# EAGLE schematic bs_prod (EAGLE 6.5.0)
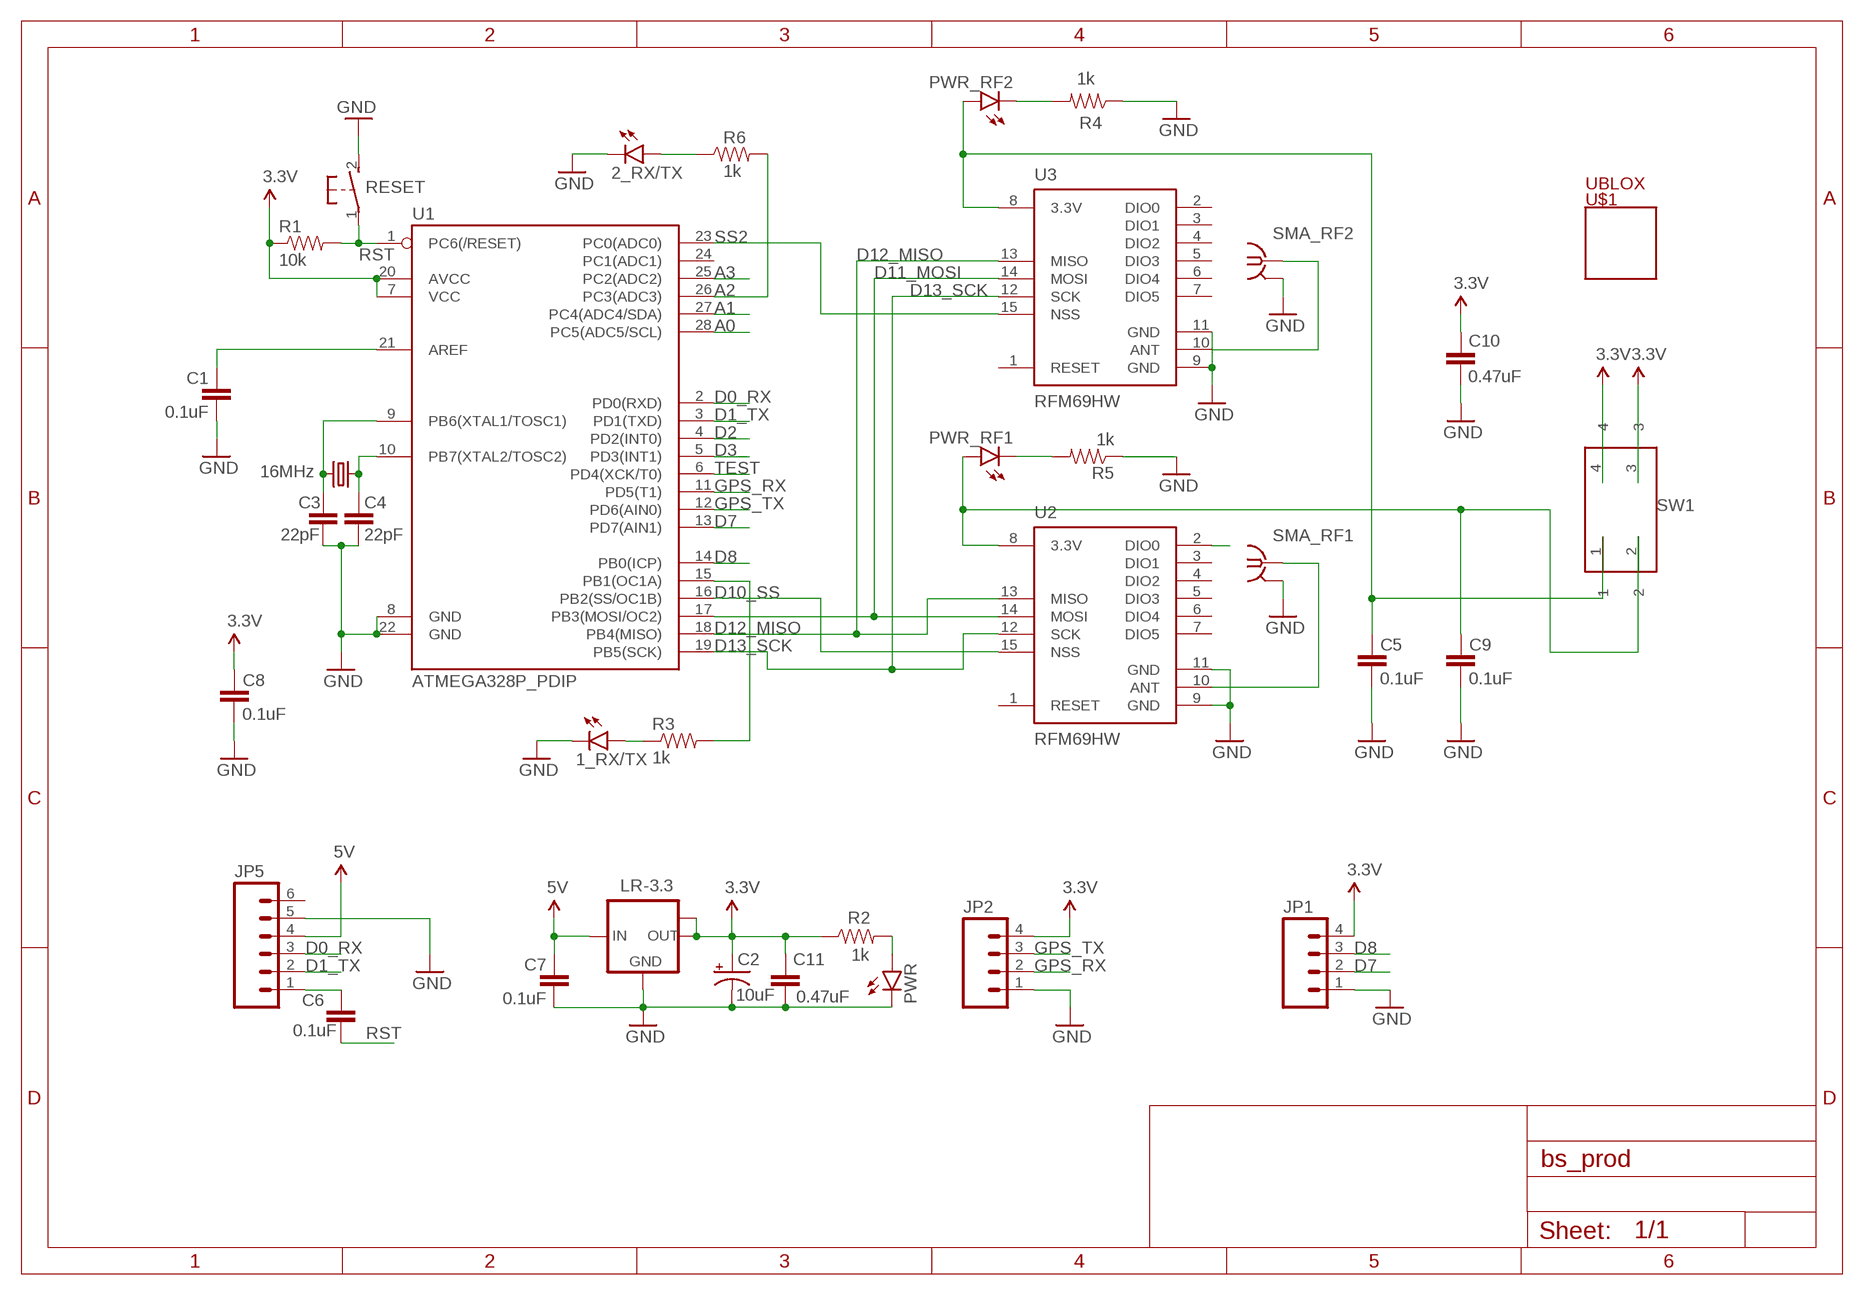
[diagram p0: schematic, sheet 1]

## Parts
1_RX/TX  LED1206  [LED-1206]
2_RX/TX  LED1206  [LED-1206]
C1  0.1uF  CAP1206  [1206]
C2  10uF  CAP_POLC  [PANASONIC_C]
C3  22pF  CAP1206  [1206]
C4  22pF  CAP1206  [1206]
C5  0.1uF  CAP1206  [1206]
C6  0.1uF  CAP1206  [1206]
C7  0.1uF  CAP1206  [1206]
C8  0.1uF  CAP1206  [1206]
C9  0.1uF  CAP1206  [1206]
C10  0.47uF  CAP1206  [1206]
C11  0.47uF  CAP1206  [1206]
JP1  M04PTH  [1X04]
JP2  M04PTH  [1X04]
JP5  M06SIP  [1X06]
LR-3.3  LM1117IMPX-3.3  [SOT223]
PWR  LED1206  [LED-1206]
PWR_RF1  LED1206  [LED-1206]
PWR_RF2  LED1206  [LED-1206]
R1  10k  RESISTOR1206  [1206]
R2  1k  RESISTOR1206  [1206]
R3  1k  RESISTOR1206  [1206]
R4  1k  RESISTOR1206  [1206]
R5  1k  RESISTOR1206  [1206]
R6  1k  RESISTOR1206  [1206]
RESET  DTSM-3  [DTSM-3]
SMA_RF1  BU-SMC-V  [BU-SMC-V]
SMA_RF2  BU-SMC-V  [BU-SMC-V]
SW1  418117270902  [418117270902]
U1  ATMEGA328P_PDIP  [DIL28-3]
U2  RFM69HW  [RFM69W-XXXS2]
U3  RFM69HW  [RFM69W-XXXS2]
U$1  UBLOX  [UBLOX]
Y1  16MHz  CRYSTALSMD  [HC49UP]

## Nets
3.3V: C2.+ C8.1 C10.1 C11.1 JP1.4 JP2.4 LR-3.3.2(OUT) LR-3.3.TAB(OUT1) R1.1 R2.1 SW1.3 SW1.4 U1.7(VCC) U1.20(AVCC)
5V: C7.1 JP5.4 LR-3.3.3(IN)
A0: U1.28(PC5(ADC5/SCL))
A1: U1.27(PC4(ADC4/SDA))
A2: R6.2 U1.26(PC3(ADC3))
A3: U1.25(PC2(ADC2))
D0_RX: JP5.3 U1.2(PD0(RXD))
D1_TX: JP5.2 U1.3(PD1(TXD))
D2: U1.4(PD2(INT0))
D3: U1.5(PD3(INT1))
D7: JP1.2 U1.13(PD7(AIN1))
D8: JP1.3 U1.14(PB0(ICP))
D10_SS: U1.16(PB2(SS/OC1B)) U2.15(NSS)
D11_MOSI: U1.17(PB3(MOSI/OC2)) U2.14(MOSI) U3.14(MOSI)
D12_MISO: U1.18(PB4(MISO)) U2.13(MISO) U3.13(MISO)
D13_SCK: U1.19(PB5(SCK)) U2.12(SCK) U3.12(SCK)
GND: 1_RX/TX.C 2_RX/TX.C C1.2 C2.- C3.2 C4.2 C5.2 C7.2 C8.2 C9.2 C10.2 C11.2 JP1.1 JP2.1 JP5.5 LR-3.3.1(GND) PWR.C R4.1 R5.1 RESET.2 SMA_RF1.2 SMA_RF1.3 SMA_RF1.4 SMA_RF1.5 SMA_RF2.2 SMA_RF2.3 SMA_RF2.4 SMA_RF2.5 U1.8(GND) U1.22(GND) U2.9(GND) U2.11(GND) U3.9(GND) U3.11(GND)
GPS_RX: JP2.2 U1.11(PD5(T1))
GPS_TX: JP2.3 U1.12(PD6(AIN0))
N$1: C5.1 PWR_RF2.A SW1.1 U3.8(3.3V)
N$2: U2.2(DIO0)
N$5: PWR.A R2.2
N$6: C3.1 U1.9(PB6(XTAL1/TOSC1)) Y1.2
N$7: C4.1 U1.10(PB7(XTAL2/TOSC2)) Y1.1
N$8: SMA_RF1.1 U2.10(ANT)
N$9: PWR_RF2.C R4.2
N$11: C6.1 JP5.1
N$12: 1_RX/TX.A R3.1
N$13: 2_RX/TX.A R6.1
N$16: C1.1 U1.21(AREF)
N$18: R3.2 U1.15(PB1(OC1A))
N$20: PWR_RF1.C R5.2
N$21: C9.1 PWR_RF1.A SW1.2 U2.8(3.3V)
N$24: SMA_RF2.1 U3.10(ANT)
RST: C6.2 R1.2 RESET.1 U1.1(PC6(/RESET))
SS2: U1.23(PC0(ADC0)) U3.15(NSS)
TEST: U1.6(PD4(XCK/T0))
Unconnected: JP5.6 U1.24(PC1(ADC1)) U2.1(RESET) U2.3(DIO1) U2.4(DIO2) U2.5(DIO3) U2.6(DIO4) U2.7(DIO5) U3.1(RESET) U3.2(DIO0) U3.3(DIO1) U3.4(DIO2) U3.5(DIO3) U3.6(DIO4) U3.7(DIO5)

## Library data of the parts
1_RX/TX 2_RX/TX PWR PWR_RF1 PWR_RF2 = SparkFun-LED:LED: LEDs Standard schematic elements and footprints for 5mm, 3mm, 1206, and 0603 sized LEDs. 5mm - Spark Fun Electronics SKU : COM-00529 (and others)
C1 C3-C11 = SparkFun-Capacitors:CAP: Capacitor Standard 0603 ceramic capacitor, and 0.1" leaded capacitor.
C2 = SparkFun-Capacitors:CAP_POL: Capacitor Polarized These are standard SMD and PTH capacitors. Normally 10uF, 47uF, and 100uF in electrolytic and tantalum varieties. Always verify the external diameter of the through hole cap, it varies with capacity, voltage, and manufacturer. The EIA devices should be standard.
JP1 JP2 = SparkFun-Connectors:M04: Header 4 Standard 4-pin 0.1" header. Use with straight break away headers (SKU : PRT-00116), right angle break away headers (PRT-00553), swiss pins (PRT-00743), machine pins (PRT-00117), and female headers (PRT-00115). Molex polarized connector foot print use with SKU : PRT-08231 with associated crimp pins and housings. 1MM SMD Version SKU: PRT-10208
JP5 = SparkFun-Connectors:M06: Header 6 Standard 6-pin 0.1" header. Use with straight break away headers (SKU : PRT-00116), right angle break away headers (PRT-00553), swiss pins (PRT-00743), machine pins (PRT-00117), and female headers (PRT-00115). Molex polarized connector foot print use with SKU : PRT-08094 with associated crimp pins and housings. NOTES ON THE VARIANTS LOCK and LOCK_LONGPADS... This footprint was designed to help hold the alignment of a through-hole component (i.e. 6-pin header) while soldering it into place. You may notice that each hole has been shifted either up or down by 0.005 of an inch from it's more standard position (which is a perfectly straight line). This slight alteration caused the pins (the squares in the middle) to touch the edges of the holes. Because they are alternating, it causes a "brace" to hold the component in place. 0.005 has proven to be the perfect amount of "off-center" position when using our standard breakaway headers. Although looks a little odd when you look at the bare footprint, once you have a header in there, the alteration is very hard to notice. Also,if you push a header all the way into place, it is covered up entirely on the bottom side. This idea of altering the position of holes to aid alignment will be further integrated into the Sparkfun Library for other footprints. It can help hold any component with 3 or more connection pins.
LR-3.3 = lm1117:LM1117IMPX-*
R1-R6 = SparkFun-Resistors:RESISTOR: Resistor Basic schematic elements and footprints for 0603, 1206, and PTH resistors.
RESET = switch-tact:DTSM-3
SMA_RF1 SMA_RF2 = con-coax:BU-SMC-V: FEMALE SMC CONNECTOR Radiall R112 426 distributor RS 295-5429; OC_FARNELL: unknown; OC_NEWARK: unknown
SW1 = Eagle_Wuerth_Elektronik_Switch:418117270902: WS-BS 2.54 mm compact THT Dip Switch with raised actuator, 2 Pole
U1 = SparkFun-DigitalIC:ATMEGA328P_PDIP: uC used in the Arduino 32kb flash, 1k EEPROM, 2k SRAM This is the through-hole version of this chip.
U2 U3 = SparkFun-RF:RFM69H
U$1 = myGps:UBLOX
Y1 = SparkFun-FreqCtrl:CRYSTAL: Various standard crystals. Proven footprints. Spark Fun Electronics SKU : COM-00534